# EAGLE design Reset Handler (EAGLE 7.4.0)
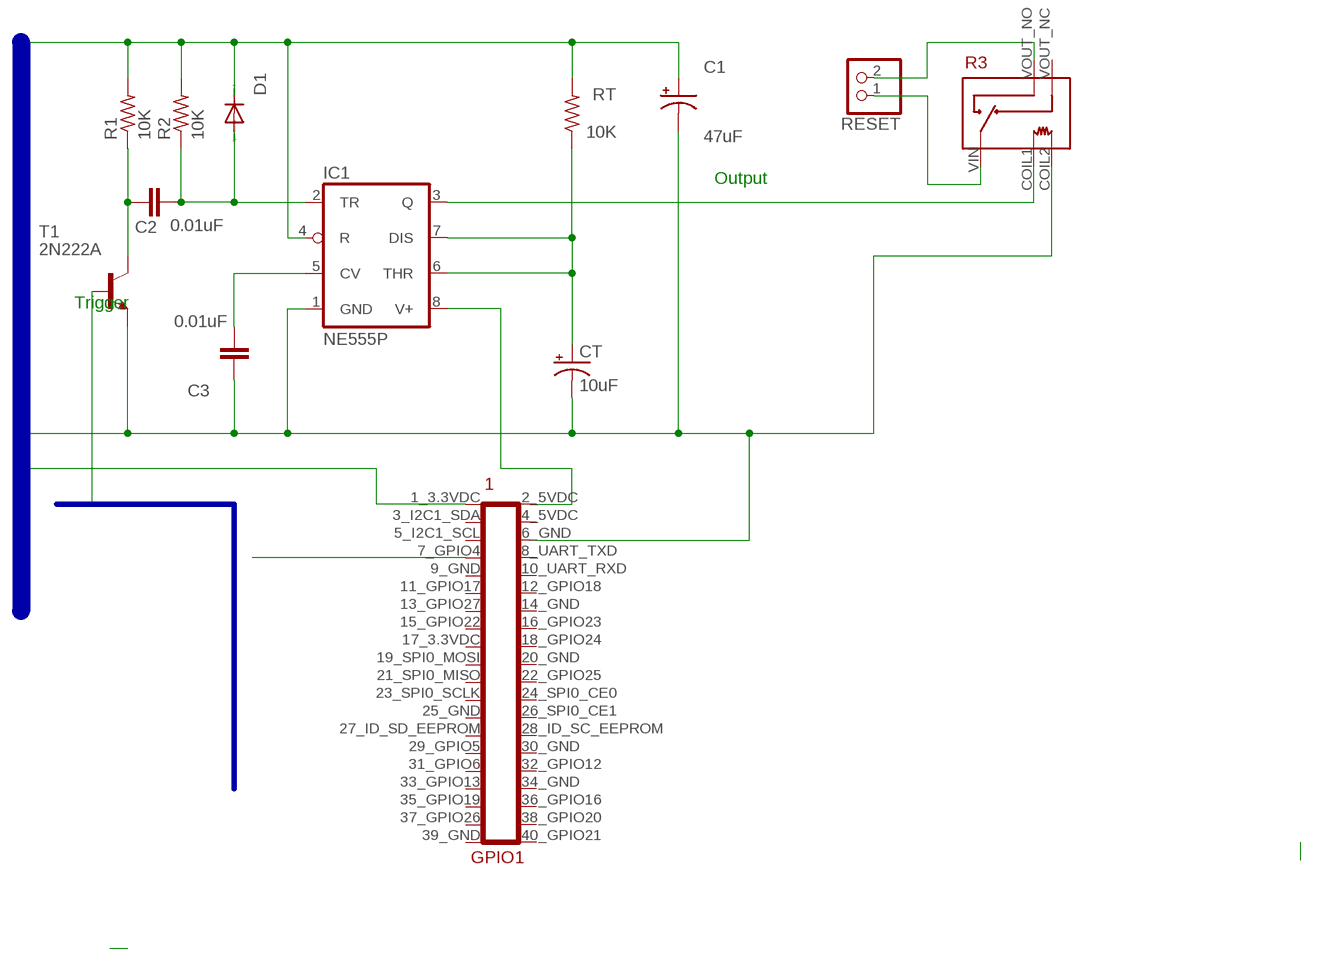
[diagram p0: schematic, sheet 1]

## Parts
C1  47uF  CPOL-USE2.5-5  [E2,5-5]
C2  0.01uF  C10/4  [C10B4]
C3  0.01uF  C10/4  [C10B4]
CT  10uF  CPOL-USE2.5-5  [E2,5-5]
D1  1N4148  1N4148DO35-7  [DO35-7]
GPIO1  RPI_GPIO_MALE_OPEN  [RPI_GPIO_FEMALE_TOP]
IC1  NE555P  [DIL08]
R1  10K  R-US_0207/10  [0207/10]
R2  10K  R-US_0207/10  [0207/10]
R3  5VDC  OUAZ-OUAZ-SS-105D  [OUAZ-SS1*]
RESET  PINHD-1X2  [1X02]
RT  10K  R-US_0207/10  [0207/10]
T1  2N222A  2N2222-NPN-TO92-EBC  [TO92-EBC]

## Nets
+3.3VDC: C1.+ D1.C GPIO1.1_3.3VDC IC1.4(R) R1.2 R2.2 RT.2
GND: C1.- C3.1 CT.- GPIO1.6_GND IC1.1(GND) R3.COIL2 T1.E
GPIO_4: GPIO1.7_GPIO4 T1.B
N$1: C2.2 R1.1 T1.C
N$2: C2.1 D1.A IC1.2(TR) R2.1
N$3: CT.+ IC1.6(THR) IC1.7(DIS) RT.1
N$4: GPIO1.2_5VDC IC1.8(V+)
N$5: C3.2 IC1.5(CV)
N$6: R3.VIN RESET.1
N$7: R3.VOUT_NO RESET.2
RESET_OUT: IC1.3(Q) R3.COIL1
Unconnected: GPIO1.3_I2C1_SDA GPIO1.5_I2C1_SCL GPIO1.8_UART_TXD(8_UART0_TXD) GPIO1.10_UART_RXD(10_UART0_RXD) GPIO1.11_GPIO17 GPIO1.12_GPIO18 GPIO1.13_GPIO27 GPIO1.15_GPIO22 GPIO1.16_GPIO23 GPIO1.18_GPIO24 GPIO1.19_SPI0_MOSI GPIO1.21_SPI0_MISO GPIO1.22_GPIO25 GPIO1.23_SPI0_SCLK GPIO1.24_SPI0_CE0 GPIO1.26_SPI0_CE1 GPIO1.27_ID_SD_EEPROM(27_ID_SC_EEPROM) GPIO1.28_ID_SC_EEPROM GPIO1.29_GPIO5 GPIO1.31_GPIO6 GPIO1.32_GPIO12 GPIO1.33_GPIO13 GPIO1.35_GPIO19 GPIO1.36_GPIO16 GPIO1.37_GPIO26 GPIO1.38_GPIO20 GPIO1.40_GPIO21 R3.VOUT_NC

## Buses
GND,+3.3VDC,+5VDC
UART0_TXD,UART0_RXD,GPIO_4,GPIO_5,GPIO_6,GPIO_12,GPIO_13,GPIO_16,GPIO_17,GPIO_18,GPIO_19,GPIO_20,GPIO_21,GPIO_22,GPIO_23,GPIO_24,GPIO_25,GPIO_26,GPIO_27

## Notes on the sheet
- Output
- Trigger

## Power pins joined to a net without a drawn wire
4_5VDC: GPIO1.4_5VDC
9_GND: GPIO1.9_GND
14_GND: GPIO1.14_GND
17_3.3VDC: GPIO1.17_3.3VDC
20_GND: GPIO1.20_GND
25_GND: GPIO1.25_GND
30_GND: GPIO1.30_GND
34_GND: GPIO1.34_GND
39_GND: GPIO1.39_GND

## Library data of the parts
C1 CT = rcl:CPOL-US: POLARIZED CAPACITOR, American symbol
C2 C3 = capacitor-wima:C: CAPACITOR naming: grid - package width
D1 = diode:1N4148: DIODE high speed (Philips)
GPIO1 = connectors:RPI_GPIO*: GPIO Connector for Raspberry Pi.
IC1 = linear:*555: TIMER
R1 R2 RT = resistor:R-US_: RESISTOR, American symbol
R3 = te-connectivity:OUAZ-*; COIL_PWR: 450mW; CONTACTS: SPDT; SEALING: Flux Proof
RESET = pinhead:PINHD-1X2: PIN HEADER
T1 = transistor-neu-to92:*-NPN-: NPN Transistror

## Board
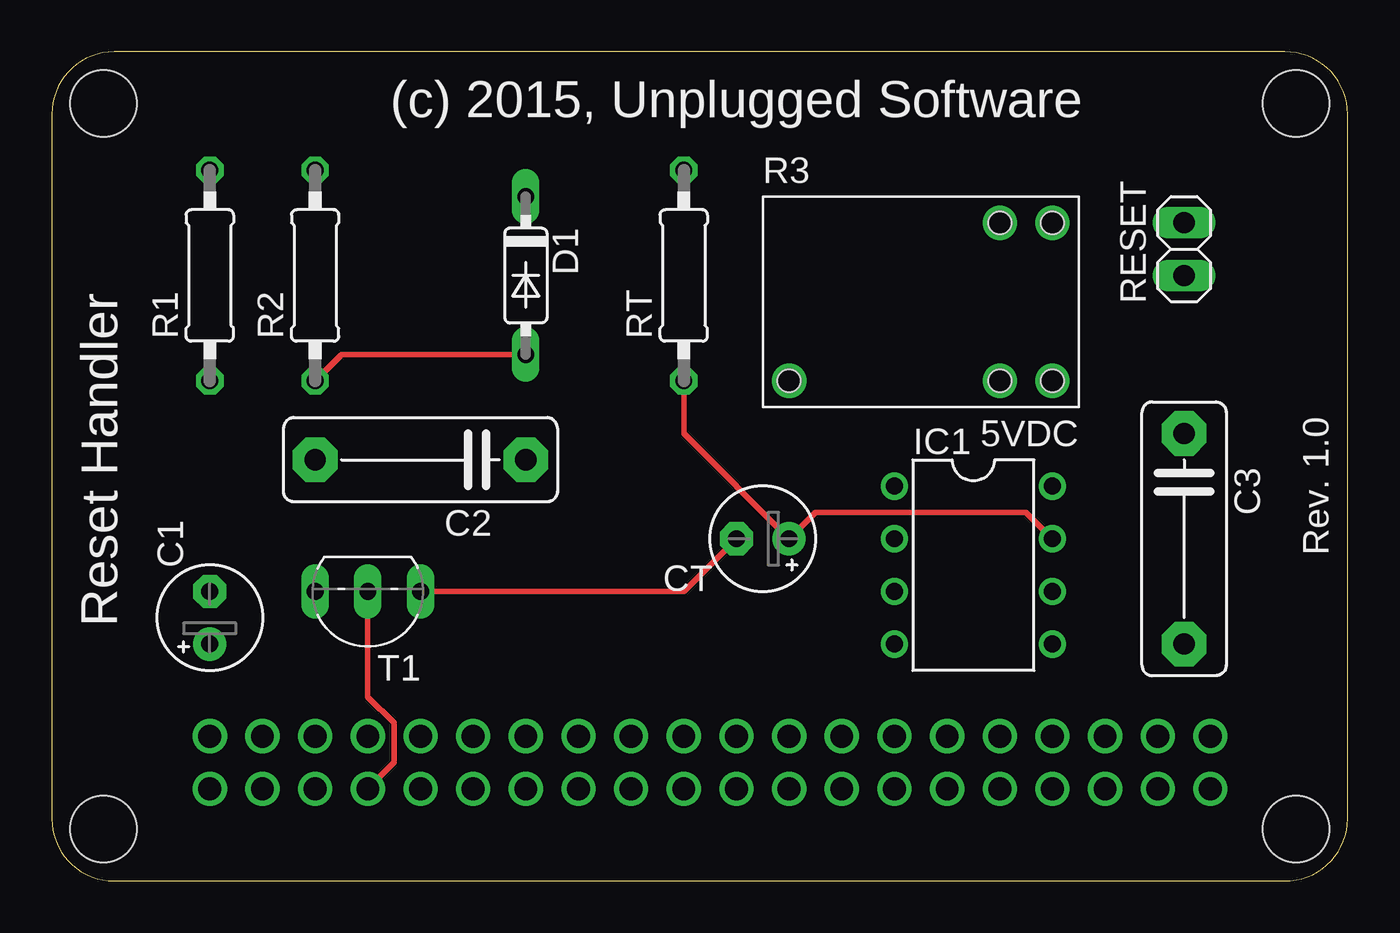
[diagram p1: board, top side]
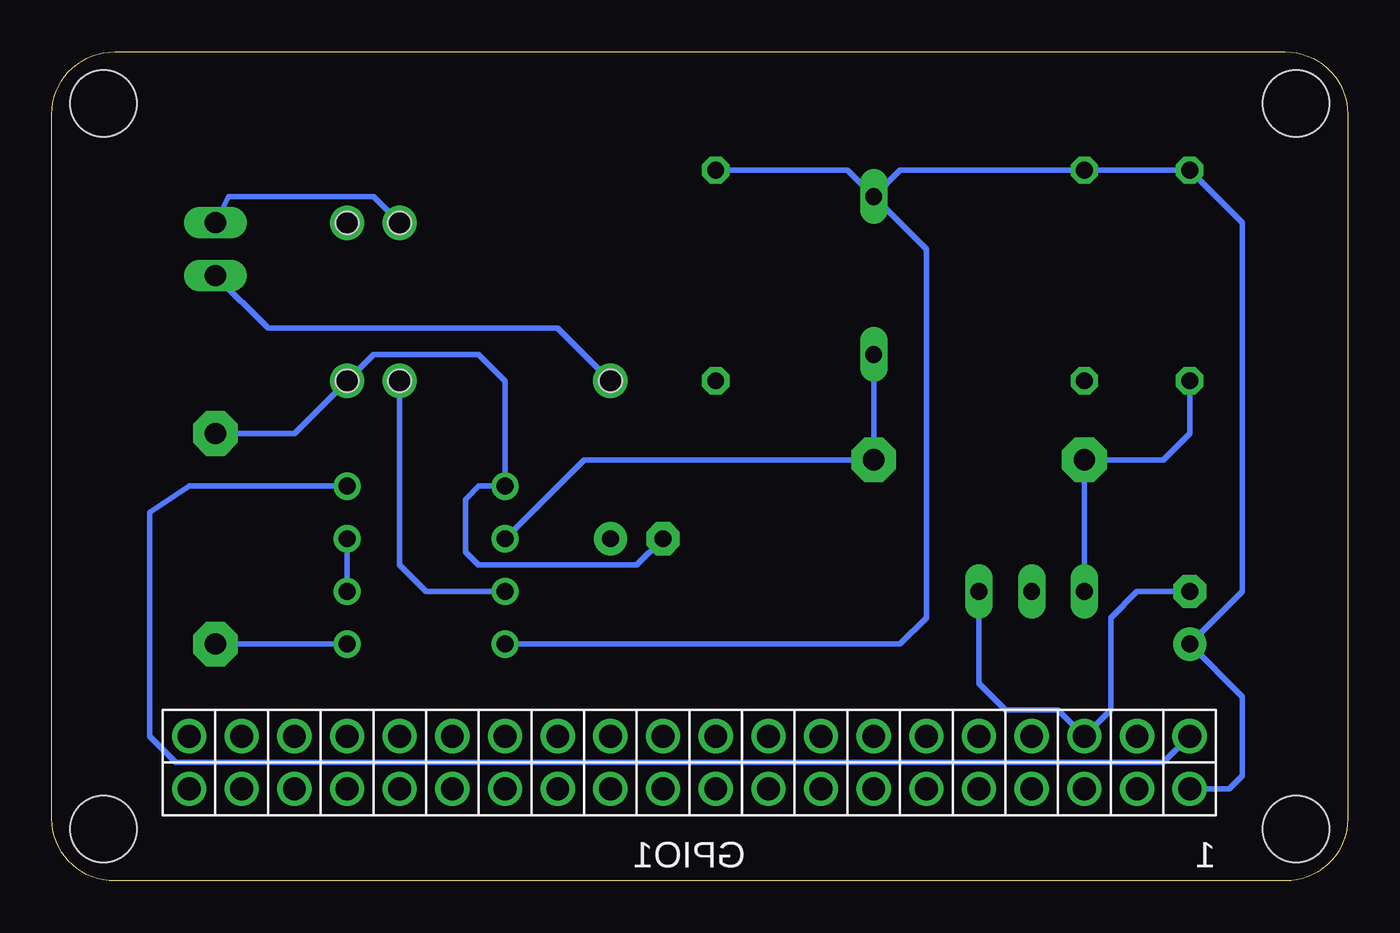
[diagram p2: board, bottom side, seen from below]

Size 62.5 x 40 mm. Coordinates in mm from the lower left corner, seen from the top.
Outline: 3,0 59.46,0 arc90 62.5,3 62.5,37 arc90 59.46,40 3,40 arc90 0,37 0,3 arc90 3,0
Copper layers (1*16): Top 0.035mm / dielectric 1.5mm / Bottom 0.035mm
Design rules "default": minimum track width 10mil, minimum drill 24mil, track to track 8mil, track to pad 8mil, pad to pad 8mil, via to via 8mil, smd to smd 8mil, copper to edge 40mil, drill to drill 8mil, minimum pad ring 10mil, minimum via ring 8mil, stop-mask expansion 4mil, vias tented up to drill 0mil, thermal gap 10mil
Holes 3.2 mm at 2.5,2.5 2.5,37.5 60,2.5 60,37.5

### Footprints (pad centres in the part's own frame; a part is rotated, then mirrored left to right if it is on the bottom)
E2,5-5 = drill 0.813 pad 1.6: + -1.27,0 | drill 0.813 pad 1.6 octagon: - 1.27,0
C10B4 = drill 1.016 pad 2.159 octagon: 1 -5.08,0; 2 5.08,0
DO35-7 = drill 0.813 long: A 3.81,0; C -3.81,0
RPI_GPIO_FEMALE_TOP = drill 1.1: 1_3.3VDC -1.27,24.13; 2_5VDC 1.27,24.13; 3_I2C1_SDA -1.27,21.59; 4_5VDC 1.27,21.59; 5_I2C1_SCL -1.27,19.05; 6_GND 1.27,19.05; 7_GPIO4 -1.27,16.51; 8_UART_TXD 1.27,16.51; 9_GND -1.27,13.97; 10_UART_RXD 1.27,13.97; 11_GPIO17 -1.27,11.43; 12_GPIO18 1.27,11.43; 13_GPIO27 -1.27,8.89; 14_GND 1.27,8.89; 15_GPIO22 -1.27,6.35; 16_GPIO23 1.27,6.35; 17_3.3VDC -1.27,3.81; 18_GPIO24 1.27,3.81; 19_SPI0_MOSI -1.27,1.27; 20_GND 1.27,1.27; 21_SPI0_MISO -1.27,-1.27; 22_GPIO25 1.27,-1.27; 23_SPI0_SCLK -1.27,-3.81; 24_SPI0_CE0 1.27,-3.81; 25_GND -1.27,-6.35; 26_SPI0_CE1 1.27,-6.35; 27_ID_SD_EEPROM -1.27,-8.89; 28_ID_SC_EEPROM 1.27,-8.89; 29_GPIO5 -1.27,-11.43; 30_GND 1.27,-11.43; 31_GPIO6 -1.27,-13.97; 32_GPIO12 1.27,-13.97; 33_GPIO13 -1.27,-16.51; 34_GND 1.27,-16.51; 35_GPIO19 -1.27,-19.05; 36_GPIO16 1.27,-19.05; 37_GPIO26 -1.27,-21.59; 38_GPIO20 1.27,-21.59; 39_GND -1.27,-24.13; 40_GPIO21 1.27,-24.13
DIL08 = drill 0.813 pad 1.27: 1 -3.81,-3.81; 2 -1.27,-3.81; 3 1.27,-3.81; 4 3.81,-3.81; 5 3.81,3.81; 6 1.27,3.81; 7 -1.27,3.81; 8 -3.81,3.81
0207/10 = drill 0.813 octagon: 1 -5.08,0; 2 5.08,0
OUAZ-SS1* = drill 1.1: COIL1 3.81,-3.81; COIL2 6.35,-3.81; VIN -6.35,-3.81; VOUT_NC 6.35,3.81; VOUT_NO 3.81,3.81 | hole 1.1: -6.35,-3.81; 3.81,-3.81; 6.35,-3.81; 6.35,3.81; 3.81,3.81
1X02 = drill 1.016 long: 1 -1.27,0; 2 1.27,0
TO92-EBC = drill 0.813 long: B 0,-1.27; C 2.54,-1.27; E -2.54,-1.27

### Placement (x,y rotation side)
C1  7.62,12.7 90 top
C2  17.78,20.32 180 top
C3  54.61,16.51 270 top
CT  34.29,16.51 180 top
D1  22.86,29.21 270 top
GPIO1  31.75,5.71 90 top
IC1  44.45,15.24 270 top
R1  7.62,29.21 90 top
R2  12.7,29.21 90 top
R3  41.91,27.94 0 top
RESET  54.61,30.48 90 top
RT  30.48,29.21 90 top
T1  15.24,12.7 180 top

### Tracks (layer width: path | path; a pad name or v marks a point on that pad's centre or on a via)
+3.3VDC
  Bottom 0.254: GPIO1.1_3.3VDC 5.71,4.45 5.08,5.08 5.08,8.89 C1.+ 5.08,13.97 5.08,31.75 R1.2 R2.2 21.59,34.29 D1.C | RT.2 24.13,34.29 D1.C | IC1.4 21.59,11.43 20.32,12.7 20.32,30.48 D1.C
GND
  Top 0.254: T1.E 30.48,13.97 CT.-
  Bottom 0.254: C3.1 50.8,21.59 R3.COIL2 46.99,25.4 41.91,25.4 40.64,24.13 IC1.1 41.91,19.05 42.55,18.41 42.55,15.88 41.91,15.24 34.29,15.24 CT.- | C1.- 10.16,13.97 11.43,12.7 11.43,8.26 GPIO1.6_GND 13.97,8.26 16.51,8.26 17.78,9.53 T1.E
GPIO_4
  Top 0.254: T1.B 15.24,8.89 16.51,7.62 16.51,5.71 GPIO1.7_GPIO4
N$1
  Bottom 0.254: R1.1 7.62,21.59 8.89,20.32 C2.2 T1.C
N$2
  Top 0.254: D1.A 13.97,25.4 R2.1
  Bottom 0.254: D1.A C2.1 36.83,20.32 IC1.2
N$3
  Top 0.254: RT.1 30.48,21.59 CT.+ 36.83,17.78 46.99,17.78 IC1.7
  Bottom 0.254: IC1.6 IC1.7
N$4
  Bottom 0.254: GPIO1.2_5VDC 8.89,5.71 56.52,5.71 57.78,6.99 57.78,17.78 55.88,19.05 IC1.8
N$5
  Bottom 0.254: C3.2 IC1.5
N$6
  Bottom 0.254: R3.VIN 38.1,26.67 52.07,26.67 RESET.1
N$7
  Bottom 0.254: R3.VOUT_NO 46.99,33.02 53.98,33.02 RESET.2
RESET_OUT
  Bottom 0.254: IC1.3 44.45,13.97 45.72,15.24 R3.COIL1

### Text on the board
tNames: (c) 2015, Unplugged Software | Reset Handler | Rev. 1.0